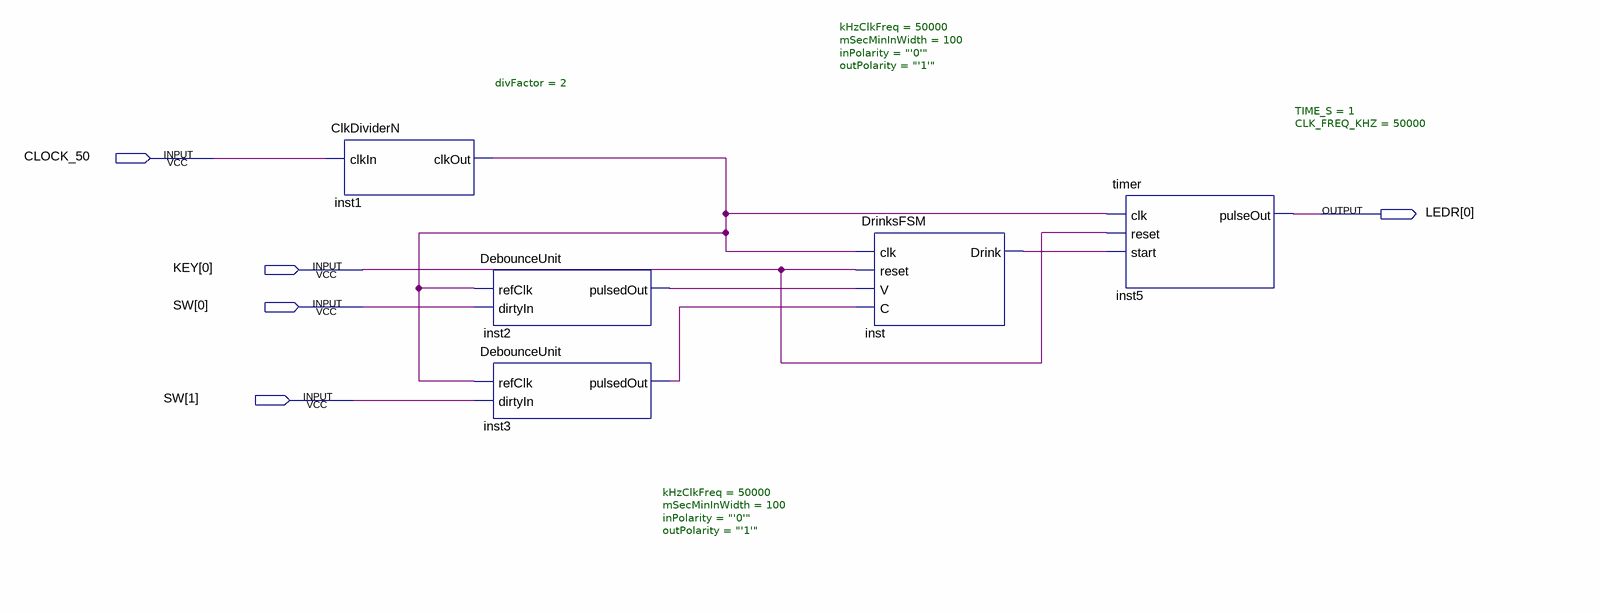
[diagram p0: schematic sheet]
// Quartus schematic DrinksMachineDemo.bdf as structural Verilog: 5 symbols, 5 pins
module DrinksMachineDemo (
  input  CLOCK_50,
  input  [0:0] KEY,
  input  [1:0] SW,
  output [0:0] LEDR
);

  wire inst1_clkout, inst2_pulsedout, inst3_pulsedout, inst_drink;

  ClkDividerN #(.divFactor(2)) inst1 (.clkIn(CLOCK_50), .clkOut(inst1_clkout));
  DebounceUnit #(.kHzClkFreq(50000), .mSecMinInWidth(100), .inPolarity("'0'"), .outPolarity("'1'")) inst2 (
    .refClk(inst1_clkout), .dirtyIn(SW[0]), .pulsedOut(inst2_pulsedout));
  DebounceUnit #(.kHzClkFreq(50000), .mSecMinInWidth(100), .inPolarity("'0'"), .outPolarity("'1'")) inst3 (
    .refClk(inst1_clkout), .dirtyIn(SW[1]), .pulsedOut(inst3_pulsedout));
  DrinksFSM inst (.clk(inst1_clkout), .reset(KEY[0]), .V(inst2_pulsedout), .C(inst3_pulsedout), .Drink(inst_drink));
  timer #(.TIME_S(1), .CLK_FREQ_KHZ(50000)) inst5 (
    .clk(inst1_clkout), .reset(KEY[0]), .start(inst_drink), .pulseOut(LEDR[0]));
endmodule
